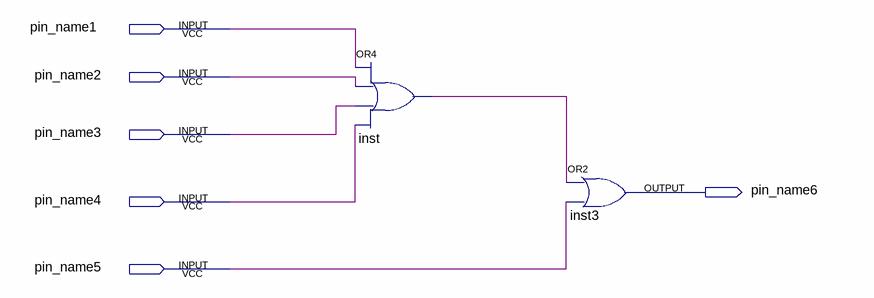
[diagram p0: schematic sheet]
// Quartus schematic OR5F.bdf as structural Verilog: 2 symbols, 6 pins
module OR5F (
  input  pin_name1,
  input  pin_name2,
  input  pin_name3,
  input  pin_name4,
  input  pin_name5,
  output pin_name6
);

  wire inst_out;

  or inst (inst_out, pin_name1, pin_name2, pin_name3, pin_name4);
  or inst3 (pin_name6, inst_out, pin_name5);
endmodule
